# EAGLE design Wind_enc_INSP (EAGLE 6.3)
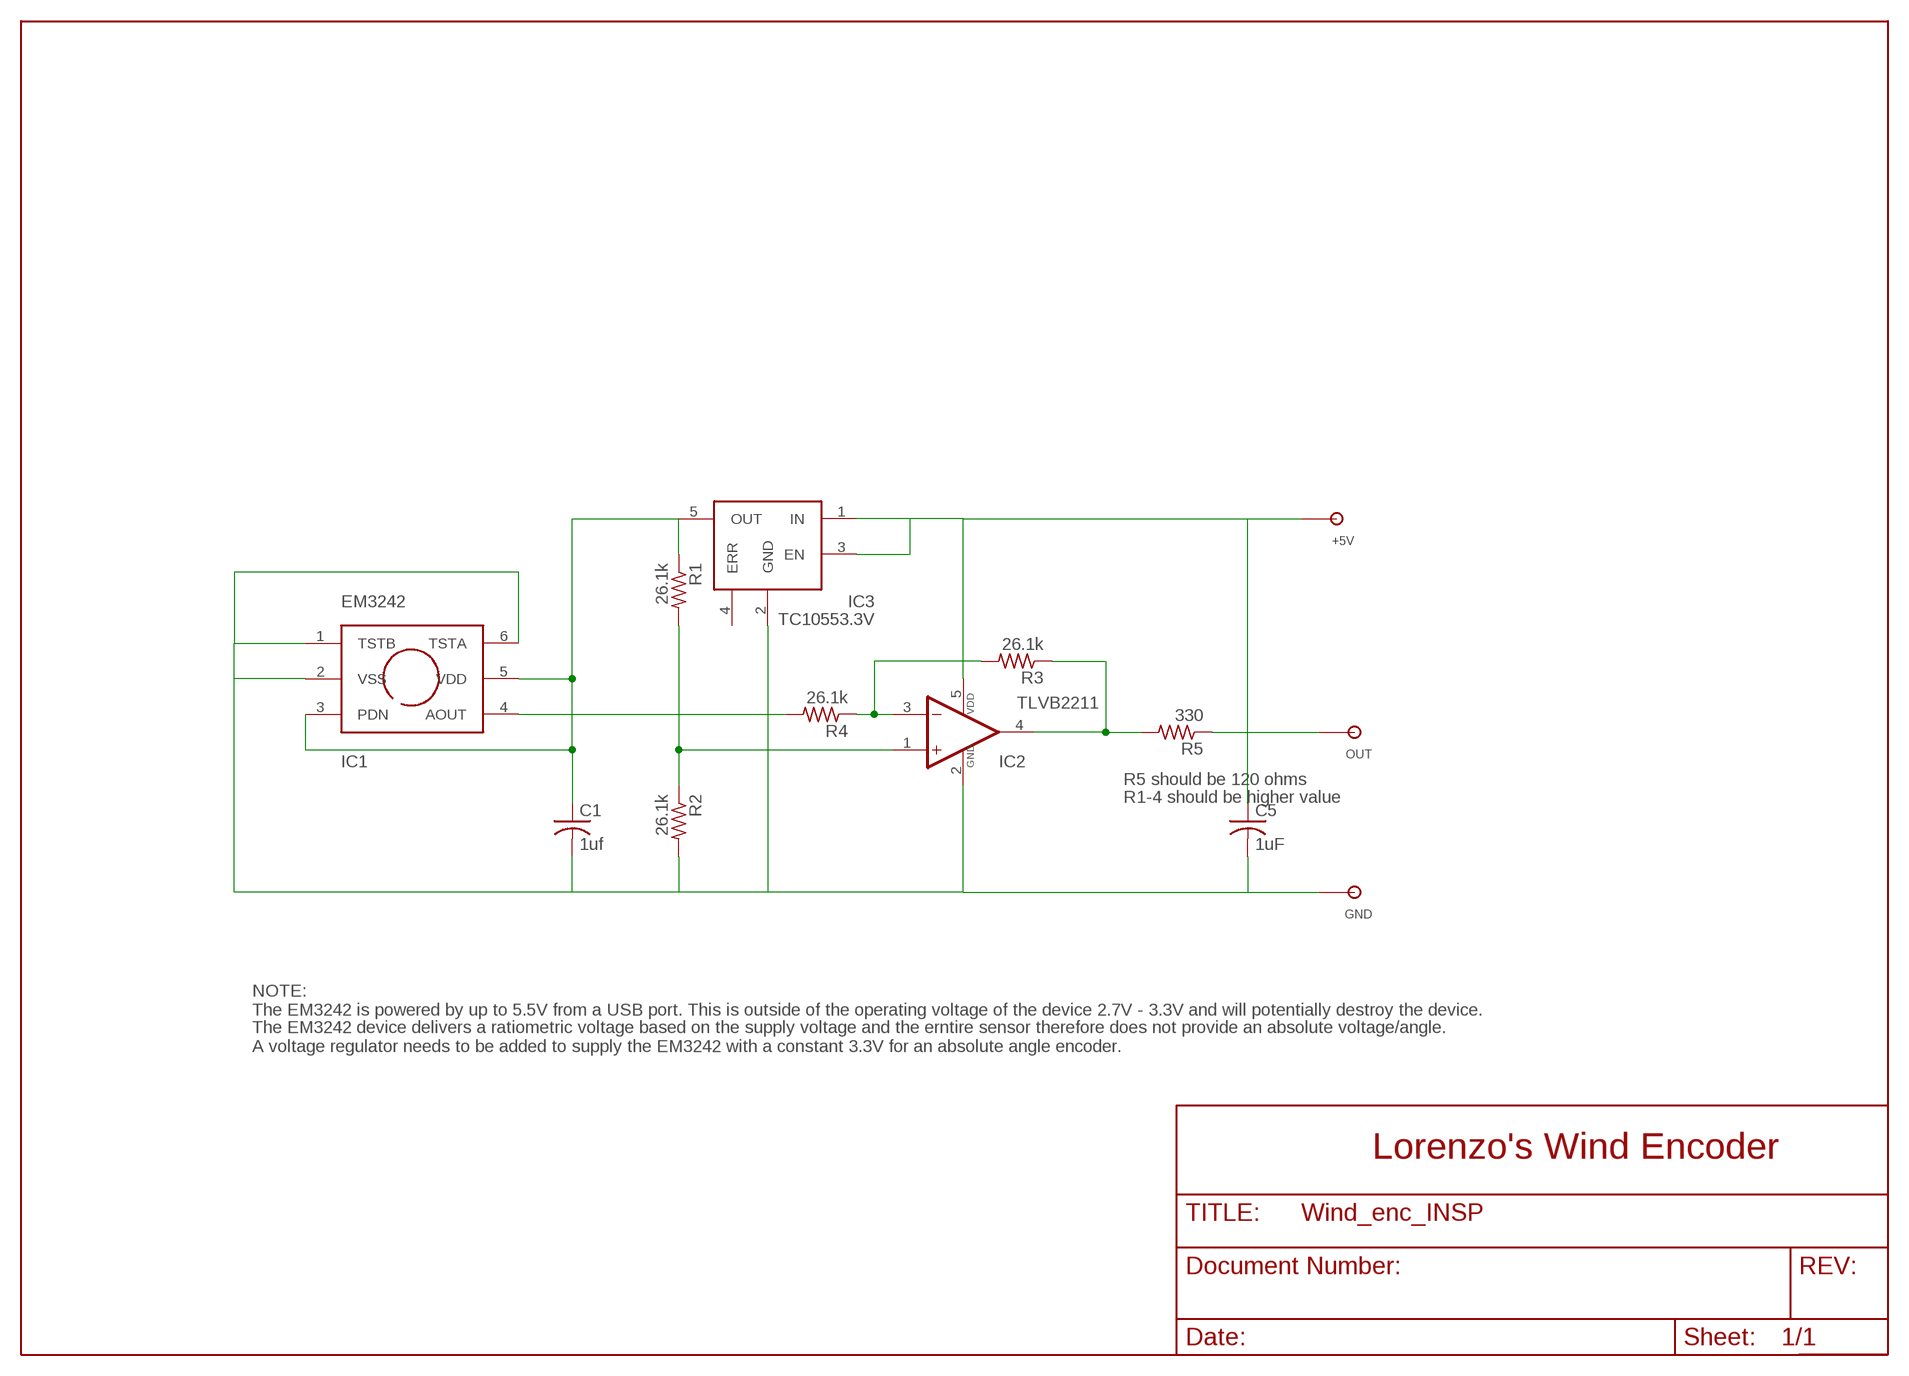
[diagram p0: schematic, sheet 1]

## Parts
+5V  TPSOL  [TP_SOL]
C1  1uf  C-USC0805K  [C0805K]
C5  1uF  C-USC0805K  [C0805K]
GND  TPSOL  [TP_SOL]
IC1  EM3242  [EM3242_SPECIAL]
IC2  TLVB2211  [SOT23-5]
IC3  TC10553.3V  [SOT23-5]
OUT  TPSOL  [TP_SOL]
R1  26.1k  R-US_R0603  [R0603]
R2  26.1k  R-US_R0603  [R0603]
R3  26.1k  R-US_R0603  [R0603]
R4  26.1k  R-US_R0603  [R0603]
R5  330  R-US_R0603  [R0603]

## Nets
N$1: +5V.P$1 C5.1 IC2.5(VDD) IC3.1(IN) IC3.3(EN)
N$2: C1.2 C5.2 GND.P$1 IC1.1(TSTB) IC1.2(VSS) IC1.6(TSTA) IC2.2(VDD_GND) IC3.2(GND) R2.2
N$3: OUT.P$1 R5.1
N$4: IC1.4(AOUT) R4.2
N$5: C1.1 IC1.3(PDN) IC1.5(VDD) IC3.5(OUT) R1.1
N$6: IC2.3(-IN) R3.2 R4.1
N$7: IC2.4(OUT) R3.1 R5.2
N$8: IC2.1(+IN) R1.2 R2.1
Unconnected: IC3.4(ERR)

## Notes on the sheet
- IC2
- R5 should be 120 ohms
- R1-4 should be higher value
- NOTE:
  The EM3242 is powered by up to 5.5V from a USB port. This is outside of the operating voltage of the device 2.7V - 3.3V and will potentially destroy the device.
- The EM3242 device delivers a ratiometric voltage based on the supply voltage and the erntire sensor therefore does not provide an absolute voltage/angle. 
  A voltage regulator needs to be added to supply the EM3242 with a constant 3.3V for an absolute angle encoder.
- Lorenzo's Wind Encoder

## Library data of the parts
+5V GND OUT = wifi_WX:TP
C1 C5 = rcl:C-US: CAPACITOR, American symbol
IC1 = 1AA_Stofer:EM3242: AsahiKasei single chip hall effect rotary encoder with DC out
IC2 = 1AA_Stofer:TLVB2211: TI Rail to Rail LINCMOS op-amp
IC3 = 1AA_Stofer:TC10553.3V
R1-R5 = rcl:R-US_: RESISTOR, American symbol

## Board
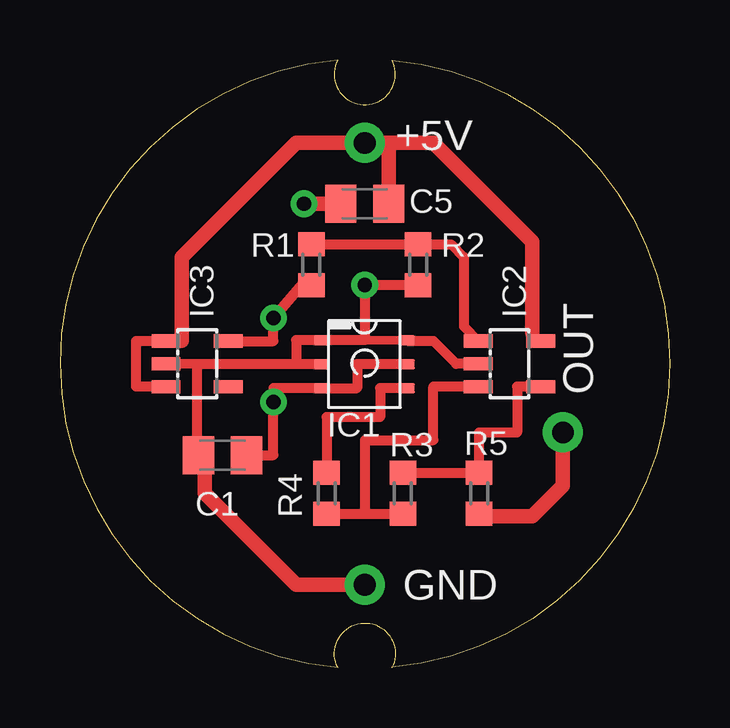
[diagram p1: board, top side]
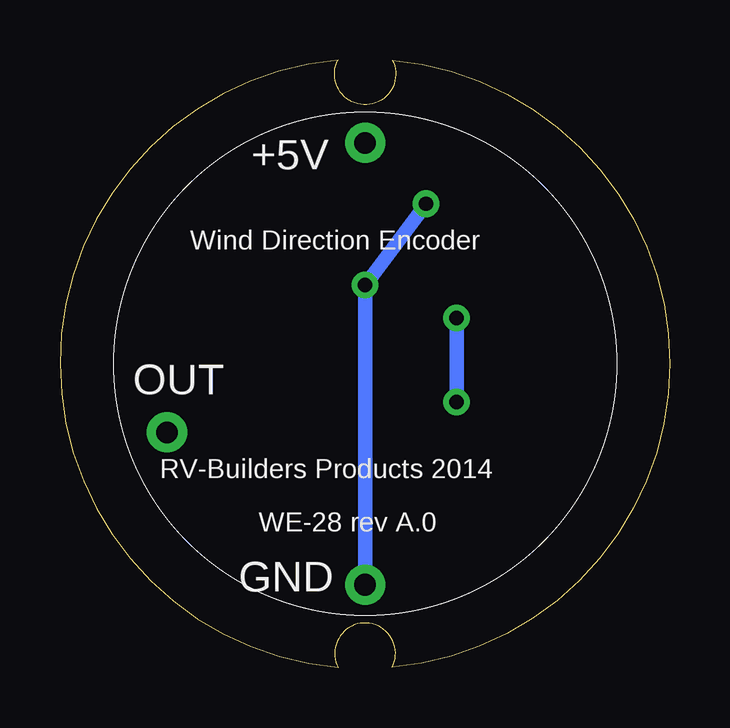
[diagram p2: board, bottom side, seen from below]

Size 25.41 x 25.32 mm. Coordinates in mm from the lower left corner, seen from the top.
Outline: 11.57,25.32 arc170 11.58,0.02
Outline: 11.57,25.32 arc235 13.83,25.32
Outline: 13.83,25.32 arc-170 13.82,0.01
Outline: 11.57,0.02 arc-235 13.83,0
Copper layers (1*16): Top 0.035mm / dielectric 1.5mm / Bottom 0.035mm
Design rules "sparkfun": minimum track width 8mil, minimum drill 20mil, track to track 8mil, track to pad 8mil, pad to pad 8mil, via to via 8mil, smd to smd 8mil, copper to edge 10mil, drill to drill 8mil, minimum pad ring 12mil, minimum via ring 10mil, stop-mask expansion 4mil, vias tented up to drill 25mil, thermal gap 10mil

### Footprints (pad centres in the part's own frame; a part is rotated, then mirrored left to right if it is on the bottom)
TP_SOL = drill 0.9 pad 1.676: P$1 0,0
C0805K = smd 1.3 x 1.6: 1 -1,0; 2 1,0
EM3242_SPECIAL = smd 0.6 x 0.4: 1 -0.3,2; 2 -0.3,1; 3 -0.3,0; 4 3.3,0; 5 3.3,1; 6 3.3,2
SOT23-5 = smd 0.55 x 1.2: 1 -0.95,-1.3; 2 0,-1.3; 3 0.95,-1.3; 4 0.95,1.3; 5 -0.95,1.3
R0603 = smd 1 x 1.1: 1 -0.85,0; 2 0.85,0

### Placement (x,y rotation side)
+5V  12.7,21.87 0 top
C1  6.77,8.85 180 top
C5  12.7,19.33 180 top
GND  12.7,3.46 0 top
IC1  11.18,11.65 0 top
IC2  18.73,12.66 270 top
IC3  5.71,12.66 270 top
OUT  20.95,9.81 0 top
R1  10.48,16.79 90 top
R2  14.92,16.79 270 top
R3  14.29,7.27 270 top
R4  11.11,7.27 90 top
R5  17.46,7.27 90 top

### Tracks (layer width: path | path; a pad name or v marks a point on that pad's centre or on a via)
N$1
  Top 0.254: 3.78,13.62 IC3.1
  Top 0.305: 3.78,13.62 5.08,13.62 | 19.68,13.96 IC2.5
  Top 0.406: 3.78,13.62 3.17,13.62 3.17,11.71 IC3.3
  Top 0.61: 5.08,13.62 5.08,17.11 9.84,21.87 +5V.P$1 13.7,21.87 | 13.7,21.87 15.56,21.87 19.68,17.74 19.68,13.96 | 13.7,21.87 C5.1
N$2  (via drill 0.6)
  Top 0.254: 5.72,8.85 C1.2 5.71,8.85
  Top 0.305: 14.51,13.62 IC1.6 | v12.7,15.94 12.8,15.94 12.7,15.84
  Top 0.356: 12.7,13.65 IC1.6
  Top 0.406: IC1.2 9.84,12.65 | 9.84,12.65 6,12.65 5.72,12.65 | 5.72,12.65 IC3.2 | 5.72,8.85 5.72,12.65 | IC2.2 16.51,12.66 15.56,13.62 14.51,13.62 | R2.2 12.8,15.94 | 12.7,15.84 12.7,13.65 IC1.1 9.84,13.65 9.84,12.65
  Top 0.61: C5.2 v10.16,19.33 | GND.P$1 9.84,3.46 6.03,7.27 6.03,8.85
  Bottom 0.61: GND.P$1 v12.7,15.94 v10.16,19.33
N$3
  Top 0.61: OUT.P$1 20.95,7.58 19.68,6.31 17.56,6.31 R5.1
N$4
  Top 0.254: IC1.4 14.29,11.65
  Top 0.406: 14.29,11.65 13.33,11.65 13.33,10.44 11.11,10.44 R4.2
N$5  (via drill 0.6)
  Top 0.305: 10.26,16.16 R1.1
  Top 0.406: IC1.5 12.38,12.65 12.38,11.65 IC1.3 8.89,11.65 v8.89,11.08 8.89,8.85 C1.1 | IC3.5 8.89,13.61 v8.89,14.57 10.26,16.16
  Bottom 0.61: v8.89,11.08 v8.89,14.57
N$6
  Top 0.406: R4.1 12.7,6.42 | 12.7,6.42 R3.2 | IC2.3 15.56,11.71 15.56,9.49 12.7,9.49 12.7,6.42
N$7
  Top 0.305: R5.2 17.78,8.22 16.51,8.12
  Top 0.406: R3.1 16.51,8.12 R5.2 17.46,9.81 19.05,9.81 19.05,11.71 IC2.4
N$8
  Top 0.406: IC2.1 16.83,14.22 16.83,17.11 16.29,17.64 R2.1 R1.2

### Text on the board
tPlace: +5V | OUT | GND
bPlace: Wind Direction Encoder | RV-Builders Products 2014 | WE-28 rev A.0